# EAGLE schematic SolarPoints (EAGLE 9.6.2)
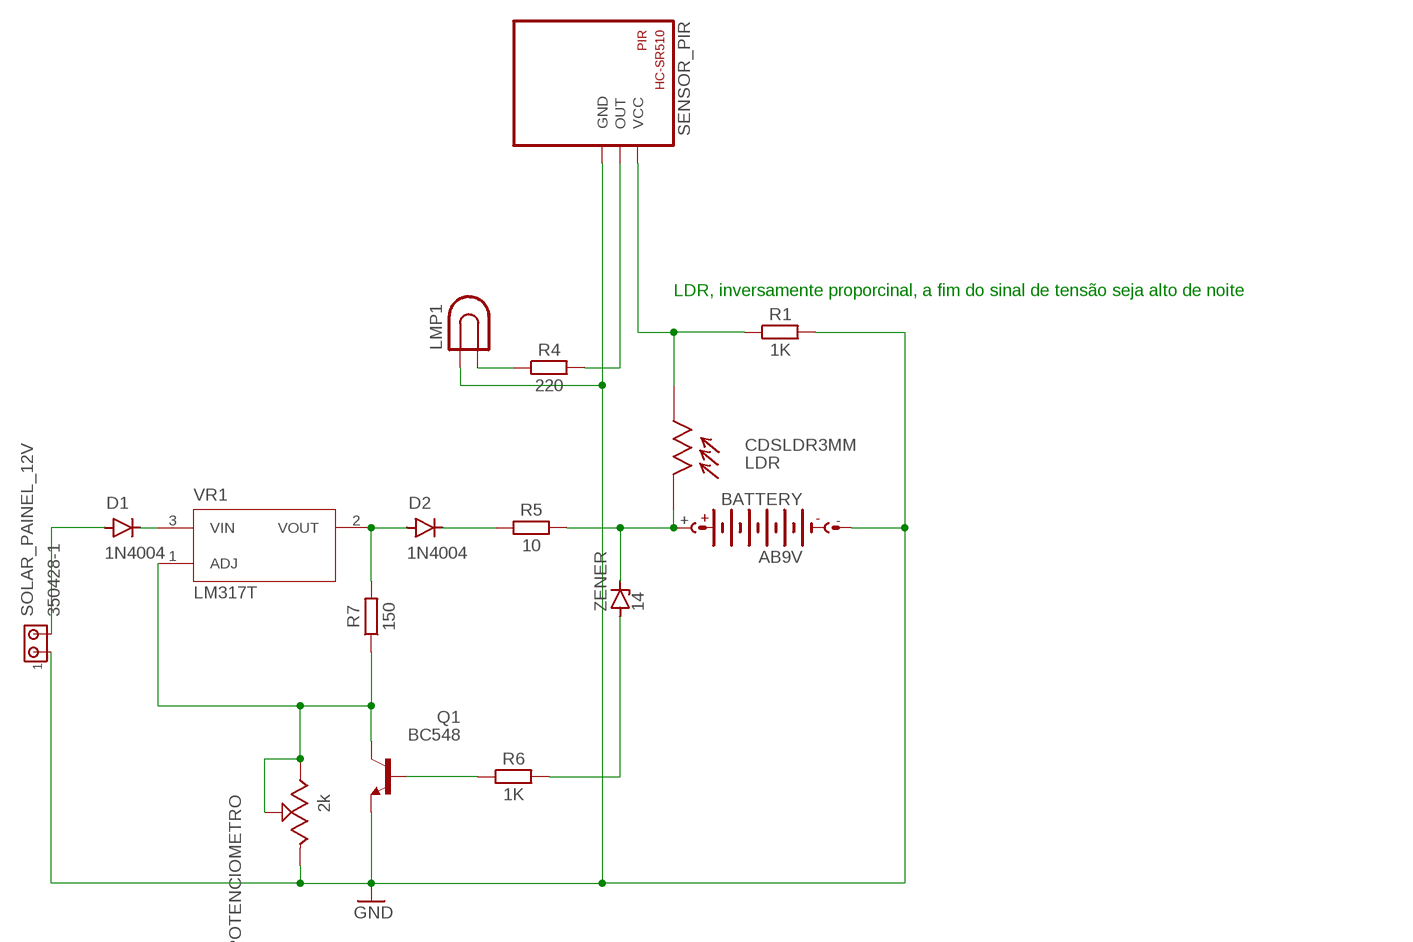
[diagram p0: schematic, sheet 1]

## Parts
BATTERY  AB9V  [AB9V]
D1  1N4004  [DO-41]
D2  1N4004  [DO-41]
LDR  CDSLDR3MM  [LDR3MM]
LMP1  LAMP  [LDH-5R]
POTENCIOMETRO  2k  91A1A-B28-B15L  [91A1A-B28-B15L-ND]
Q1  BC548  [TO92-EBC]
R1  1K  RESISTOR_AXIAL-10.16MM-PITCH  [RESAD1016W63L850D250B]
R4  220  RESISTOR_AXIAL-10.16MM-PITCH  [RESAD1016W63L850D250B]
R5  10  RESISTOR_AXIAL-10.16MM-PITCH  [RESAD1016W63L850D250B]
R6  1K  RESISTOR_AXIAL-10.16MM-PITCH  [RESAD1016W63L850D250B]
R7  150  RESISTOR_AXIAL-10.16MM-PITCH  [RESAD1016W63L850D250B]
SENSOR_PIR  HC-SR501  [HC-SR501]
SOLAR_PAINEL_12V  350428-1  [350428-1]
VR1  LM317T  [TO254P1054X470X1955-3]
ZENER  14  BZV10  [DO34Z7]

## Nets
GND: BATTERY.- LMP1.1 POTENCIOMETRO.1 Q1.E R1.2 SENSOR_PIR.GND SOLAR_PAINEL_12V.1
N$1: BATTERY.+ LDR.P$1 R5.2 ZENER.C
N$2: R6.2 ZENER.A
N$3: Q1.B R6.1
N$4: POTENCIOMETRO.2 POTENCIOMETRO.3 Q1.C R7.1 VR1.1(ADJ)
N$5: D2.A R7.2 VR1.2(VOUT)
N$6: D2.C R5.1
N$7: LMP1.2 R4.1
N$8: D1.A SOLAR_PAINEL_12V.2
N$9: D1.C VR1.3(VIN)
N$10: R4.2 SENSOR_PIR.OUT
N$12: LDR.P$2 R1.1 SENSOR_PIR.VCC

## Notes on the sheet
- LDR, inversamente proporcinal, a fim do sinal de tensão seja alto de noite

## Library data of the parts
BATTERY = battery:AB9V: 9-V BATTERY CLIP
D1 D2 = Diodes:1N4004: DIODE GEN PURP 400V 1A DO41 Manufacturer's datasheet <https://www.mccsemi.com/pdf/Products/1N4001-1N4007(DO-41).pdf>; CREATED_BY: PCBLayout.com; DIGIKEY_PART_NUMBER: 1N4004MSCT-ND; MANUFACTURER: Micro Commercial Co; MPN: 1N4004; PACKAGE: DO-41
LDR = CEDTv40:CDSLDR3MM
LMP1 = special:LAMP: LED HOLDER
POTENCIOMETRO = Potentiometer_Trimmers:91A1A-B28-B15L: POT 10K OHM 1W PLASTIC LINEAR Manufacturer's datasheet <https://www.bourns.com/docs/Product-Datasheets/91_95.pdf>; CREATED_BY: PCBLayout.com; DIGIKEY_PARTNO: 91A1A-B28-B15L-ND; MANUFACTURER: Bourns Inc.; MPN: 91A1A-B28-B15L
Q1 = transistor-npn:BC548*: NPN Transistor
R1 R4-R7 = Tinkercad:RESISTOR: Resistor Fixed - Generic
SENSOR_PIR = Sensors_PIR_Lux:HC-SR501: PIR Module HC-SR501
SOLAR_PAINEL_12V = con-amp:350428-1: Universal MATE-N-LOK .250" Centerline, 600 V, 19 - 36 A max Source: http://catalog.tycoelectronics.com/ .. ENG_CD_350428_Y.pdf
VR1 = LM317T:LM317T: Check availability <https://pricing.snapeda.com/parts/LM317T/Texas%20Instruments/view-part?ref=eda>; AVAILABILITY: In Stock; CHECK_PRICES: https://www.snapeda.com/parts/LM317T/Texas+Instruments/view-part/?ref=eda; DESCRIPTION: 1.5-A, 40-V, adjustable linear voltage regulator 3-TO-220; MF: Texas Instruments; MP: LM317T; PACKAGE: TO-220-3 Texas Instruments; PRICE: None; SNAPEDA_LINK: https://www.snapeda.com/parts/LM317T/Texas+Instruments/view-part/?ref=snap
ZENER = diode:BZV10: Z DIODE; SPICEPREFIX: B